# EAGLE design SPO2 New (EAGLE 7.7.0)
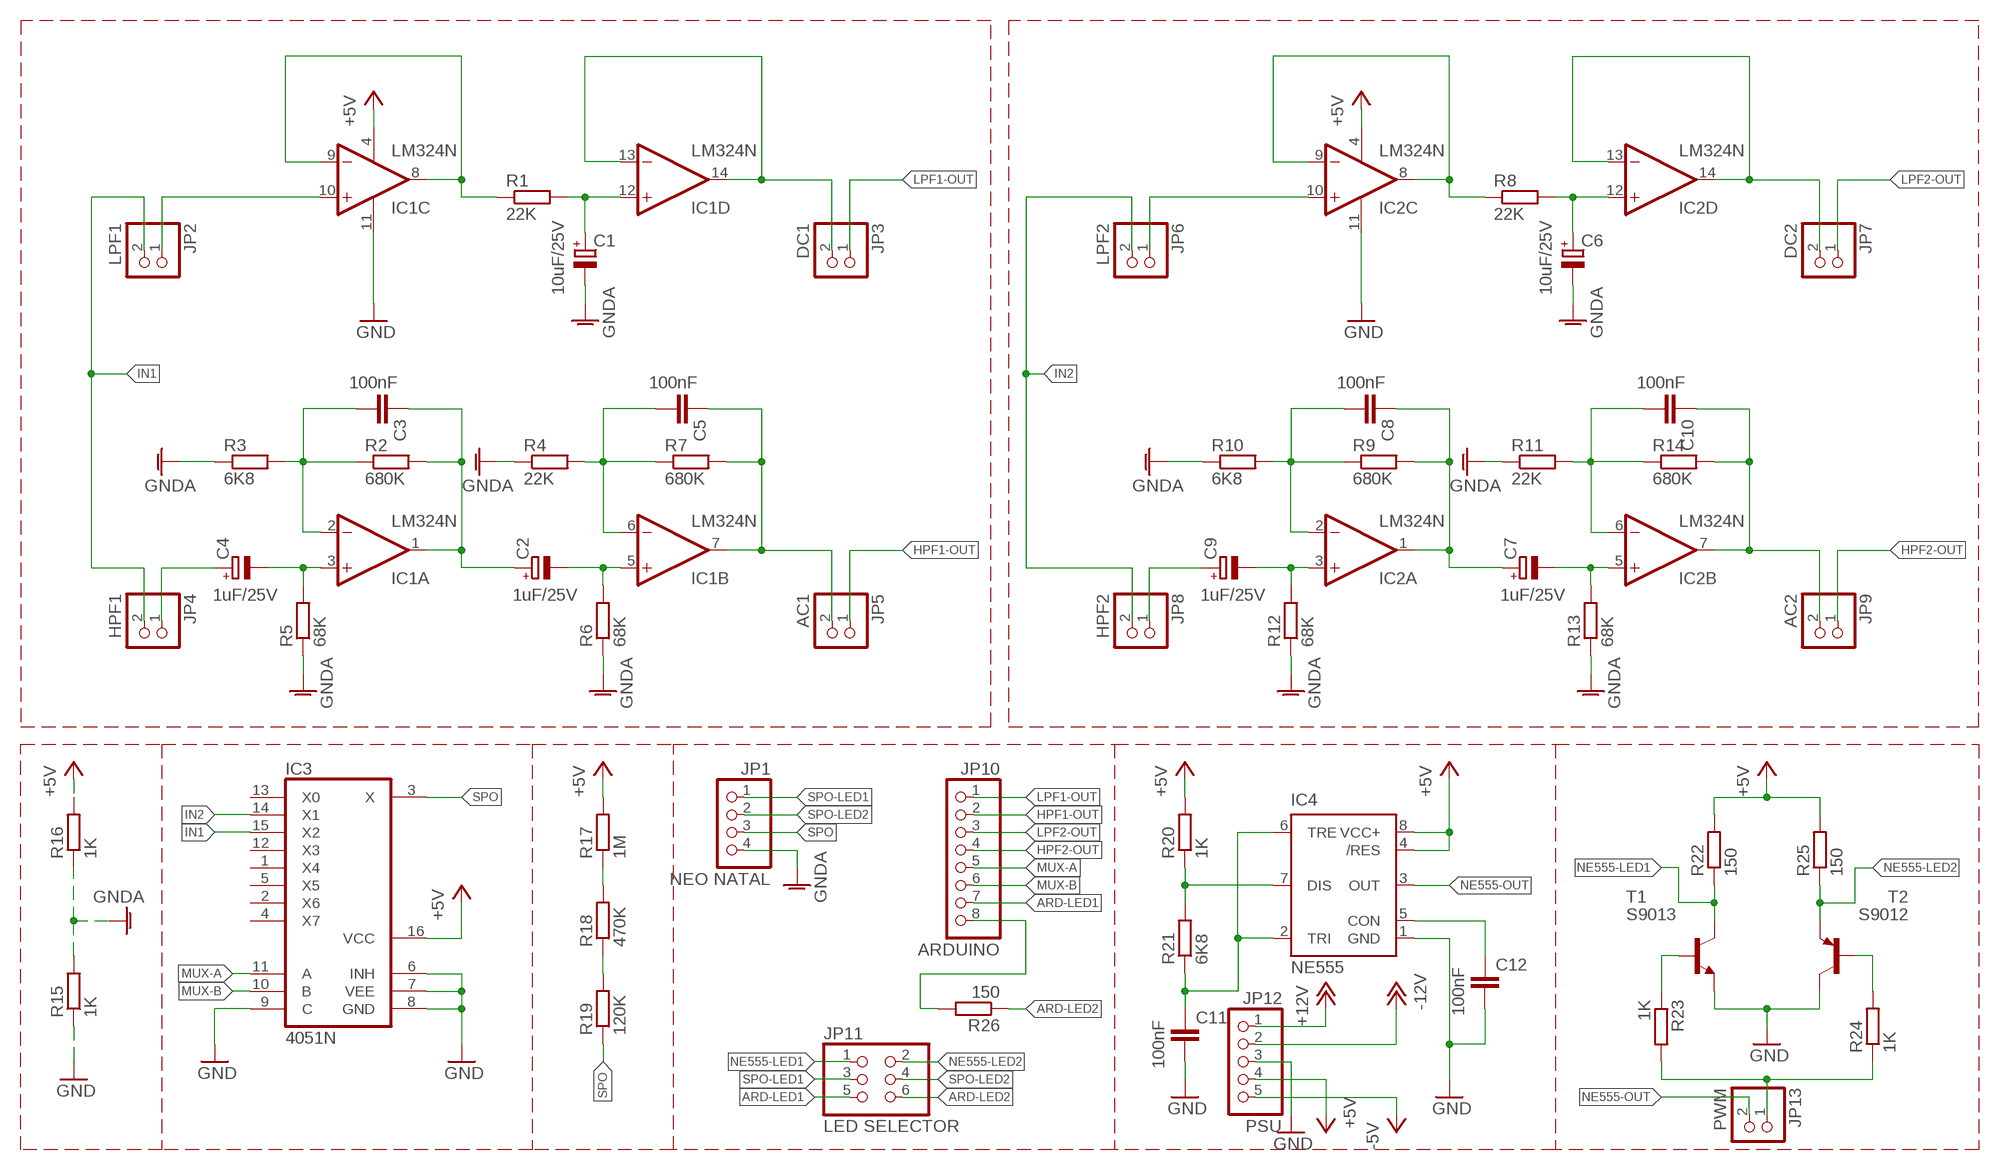
[diagram p0: schematic, sheet 1]

## Parts
C1  10uF/25V  CPOL-EUE2.5-6  [E2,5-6]
C2  1uF/25V  CPOL-EUE2.5-6  [E2,5-6]
C3  100nF  C-EU050-025X075  [C050-025X075]
C4  1uF/25V  CPOL-EUE2.5-6  [E2,5-6]
C5  100nF  C-EU050-025X075  [C050-025X075]
C6  10uF/25V  CPOL-EUE2.5-6  [E2,5-6]
C7  1uF/25V  CPOL-EUE2.5-6  [E2,5-6]
C8  100nF  C-EU050-025X075  [C050-025X075]
C9  1uF/25V  CPOL-EUE2.5-6  [E2,5-6]
C10  100nF  C-EU050-025X075  [C050-025X075]
C11  100nF  C-EU050-025X075  [C050-025X075]
C12  100nF  C-EU050-025X075  [C050-025X075]
IC1  LM324N  [DIL14]
IC2  LM324N  [DIL14]
IC3  4051N  [DIL16]
IC4  NE555  [DIL-08]
JP1  NEO NATAL  PINHD-1X4  [1X04]
JP2  LPF1  PINHD-1X2  [1X02]
JP3  DC1  PINHD-1X2  [1X02]
JP4  HPF1  PINHD-1X2  [1X02]
JP5  AC1  PINHD-1X2  [1X02]
JP6  LPF2  PINHD-1X2  [1X02]
JP7  DC2  PINHD-1X2  [1X02]
JP8  HPF2  PINHD-1X2  [1X02]
JP9  AC2  PINHD-1X2  [1X02]
JP10  ARDUINO  PINHD-1X8  [1X08]
JP11  LED SELECTOR  PINHD-2X3  [2X03]
JP12  PSU  PINHD-1X5"  [1X05]
JP13  PWM  PINHD-1X2  [1X02]
R1  22K  R-EU_0207/7  [0207/7]
R2  680K  R-EU_0207/7  [0207/7]
R3  6K8  R-EU_0207/7  [0207/7]
R4  22K  R-EU_0207/7  [0207/7]
R5  68K  R-EU_0207/7  [0207/7]
R6  68K  R-EU_0207/7  [0207/7]
R7  680K  R-EU_0207/7  [0207/7]
R8  22K  R-EU_0207/7  [0207/7]
R9  680K  R-EU_0207/7  [0207/7]
R10  6K8  R-EU_0207/7  [0207/7]
R11  22K  R-EU_0207/7  [0207/7]
R12  68K  R-EU_0207/7  [0207/7]
R13  68K  R-EU_0207/7  [0207/7]
R14  680K  R-EU_0207/7  [0207/7]
R15  1K  R-EU_0207/7  [0207/7]
R16  1K  R-EU_0207/7  [0207/7]
R17  1M  R-EU_0207/7  [0207/7]
R18  470K  R-EU_0207/7  [0207/7]
R19  120K  R-EU_0207/7  [0207/7]
R20  1K  R-EU_0207/7  [0207/7]
R21  6K8  R-EU_0207/7  [0207/7]
R22  150  R-EU_0207/7  [0207/7]
R23  1K  R-EU_0207/7  [0207/7]
R24  1K  R-EU_0207/7  [0207/7]
R25  150  R-EU_0207/7  [0207/7]
R26  150  R-EU_0207/7  [0207/7]
T1  S9013  BC319-NPN-TO92-EBC  [TO92-EBC]
T2  S9012  BC327-16-PNP-TO92-EBC  [TO92-EBC]

## Nets
+5V: IC1.4(P:V+) IC2.4(P:V+) IC3.16(VCC) IC4.4(/RES) IC4.8(VCC+) JP12.4 R16.2 R17.2 R20.2 R22.2 R25.2
+12V: JP12.1
-5V: JP12.5
-12V: JP12.2
ARD-LED1: JP10.7 JP11.5
ARD-LED2: JP11.6 R26.1
GND: C11.2 C12.2 IC1.11(P:V-) IC2.11(P:V-) IC3.6(INH) IC3.7(VEE) IC3.8(GND) IC3.9(C) IC4.1(GND) JP12.3 R15.1 T1.E T2.C
GNDA: C1.- C6.- JP1.4 R3.1 R4.1 R5.1 R6.1 R10.1 R11.1 R12.1 R13.1 R15.2 R16.1
HPF1-OUT: JP5.1 JP10.2
HPF2-OUT: JP9.1 JP10.4
IN1: IC3.15(X2) JP2.2 JP4.2
IN2: IC3.14(X1) JP6.2 JP8.2
LPF1-OUT: JP3.1 JP10.1
LPF2-OUT: JP7.1 JP10.3
MUX-A: IC3.11(A) JP10.5
MUX-B: IC3.10(B) JP10.6
N$1: C1.+ IC1.12(D:+IN) R1.2
N$2: IC1.13(D:-IN) IC1.14(D:OUT) JP3.2
N$3: IC1.8(C:OUT) IC1.9(C:-IN) R1.1
N$4: IC1.10(C:+IN) JP2.1
N$5: C6.+ IC2.12(D:+IN) R8.2
N$6: IC2.8(C:OUT) IC2.9(C:-IN) R8.1
N$7: C3.2 IC1.2(A:-IN) R2.1 R3.2
N$8: C5.2 IC1.6(B:-IN) R4.2 R7.1
N$9: C2.+ C3.1 IC1.1(A:OUT) R2.2
N$10: C2.- IC1.5(B:+IN) R6.2
N$11: C4.- IC1.3(A:+IN) R5.2
N$12: IC2.13(D:-IN) IC2.14(D:OUT) JP7.2
N$13: C4.+ JP4.1
N$14: C8.2 IC2.2(A:-IN) R9.1 R10.2
N$15: C7.+ C8.1 IC2.1(A:OUT) R9.2
N$16: C5.1 IC1.7(B:OUT) JP5.2 R7.2
N$17: C7.- IC2.5(B:+IN) R13.2
N$18: C10.2 IC2.6(B:-IN) R11.2 R14.1
N$19: C9.- IC2.3(A:+IN) R12.2
N$20: C9.+ JP8.1
N$21: C10.1 IC2.7(B:OUT) JP9.2 R14.2
N$22: IC2.10(C:+IN) JP6.1
N$23: IC4.7(DIS) R20.1 R21.2
N$24: R18.1 R19.2
N$25: R17.1 R18.2
N$26: C11.1 IC4.2(TRI) IC4.6(TRE) R21.1
N$27: C12.1 IC4.5(CON)
N$28: R24.2 T2.B
N$29: R23.1 T1.B
N$30: JP10.8 R26.2
N$35: JP13.1 R23.2 R24.1
NE555-LED1: JP11.1 R22.1 T1.C
NE555-LED2: JP11.2 R25.1 T2.E
NE555-OUT: IC4.3(OUT) JP13.2
SPO: IC3.3(X) JP1.3 R19.1
SPO-LED1: JP1.1 JP11.3
SPO-LED2: JP1.2 JP11.4
Unconnected: IC3.1(X4) IC3.2(X6) IC3.4(X7) IC3.5(X5) IC3.12(X3) IC3.13(X0)

## Library data of the parts
C1 C2 C4 C6 C7 C9 = FansElectronics-RCL:CPOL-EU: POLARIZED CAPACITOR, European symbol
C3 C5 C8 C10-C12 = FansElectronics-RCL:C-EU: CAPACITOR, European symbol
IC1 IC2 = linear:LM324: OP AMP
IC3 = 40xx:4051: 8-channel ANALOG MULTIPLEXER
IC4 = st-microelectronics:NE555: General purpose bipolar Timer; MF: Arrow Electronics; MPN: NE555N; OC_FARNELL: 1467742; OC_NEWARK: 89K1486
JP1 = FansElectronics-Header:PINHD-1X4: PIN HEADER
JP2-JP9 JP13 = FansElectronics-Header:PINHD-1X2: PIN HEADER
JP10 = FansElectronics-Header:PINHD-1X8: PIN HEADER
JP11 = FansElectronics-Header:PINHD-2X3: PIN HEADER
JP12 = FansElectronics-Header:PINHD-1X5: PIN HEADER
R1-R26 = FansElectronics-RCL:R-EU_: RESISTOR, European symbol
T1 = transistor:*-NPN-: NPN Transistror BF959 corrected 2008.03.06
T2 = transistor:*-PNP-: PNP Transistror

## Board
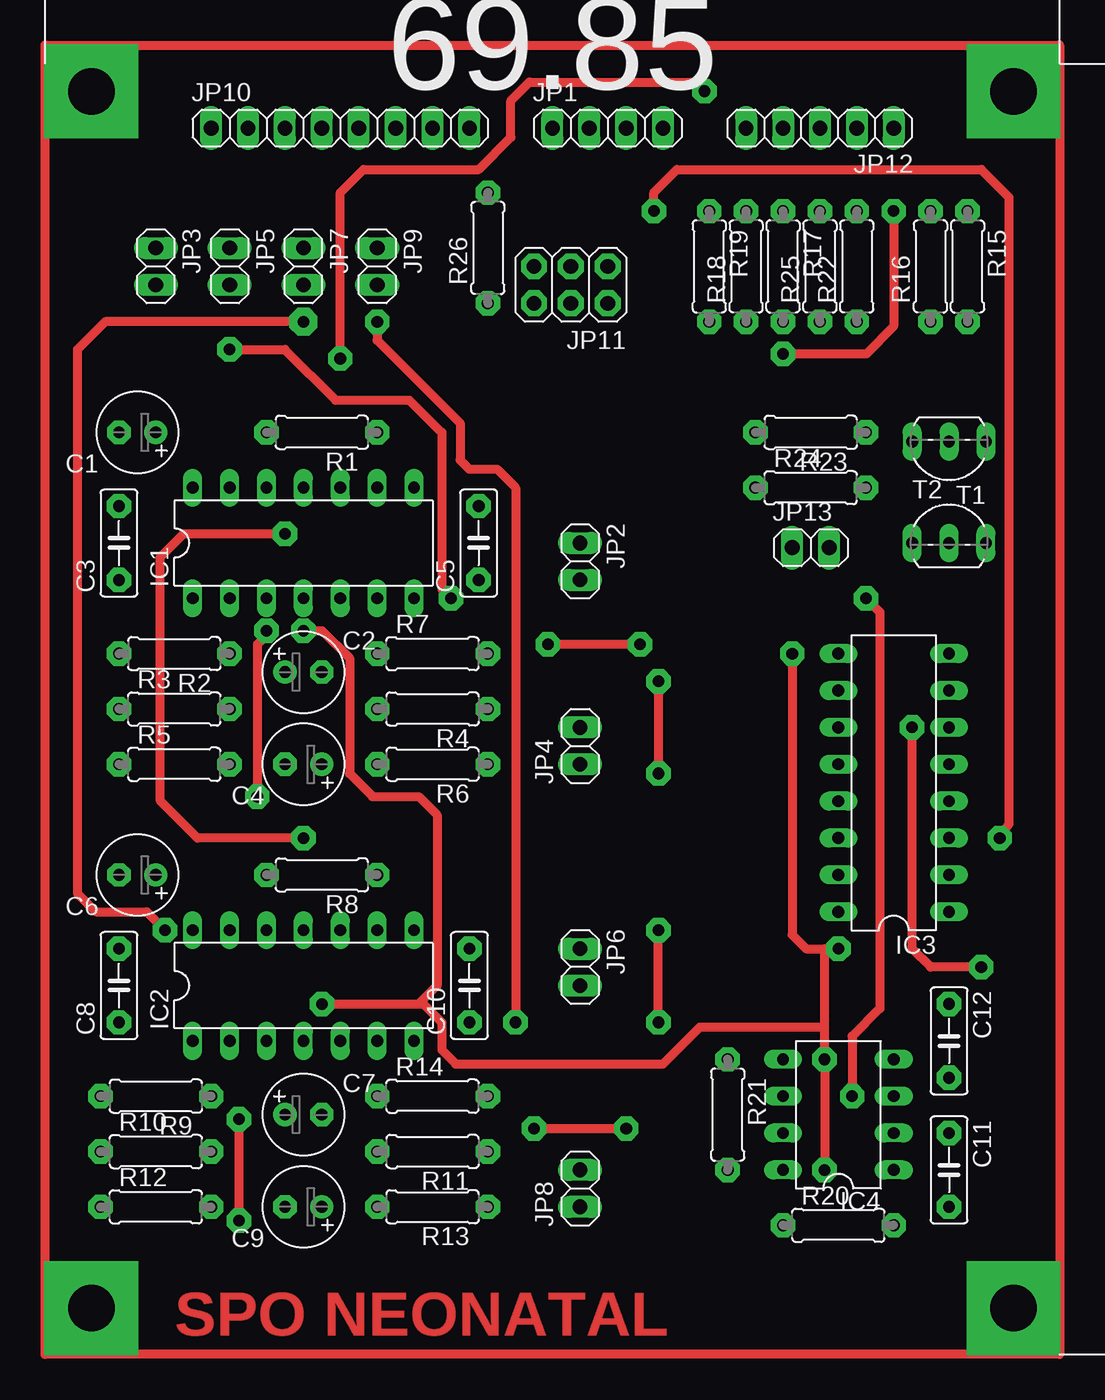
[diagram p1: board, top side]
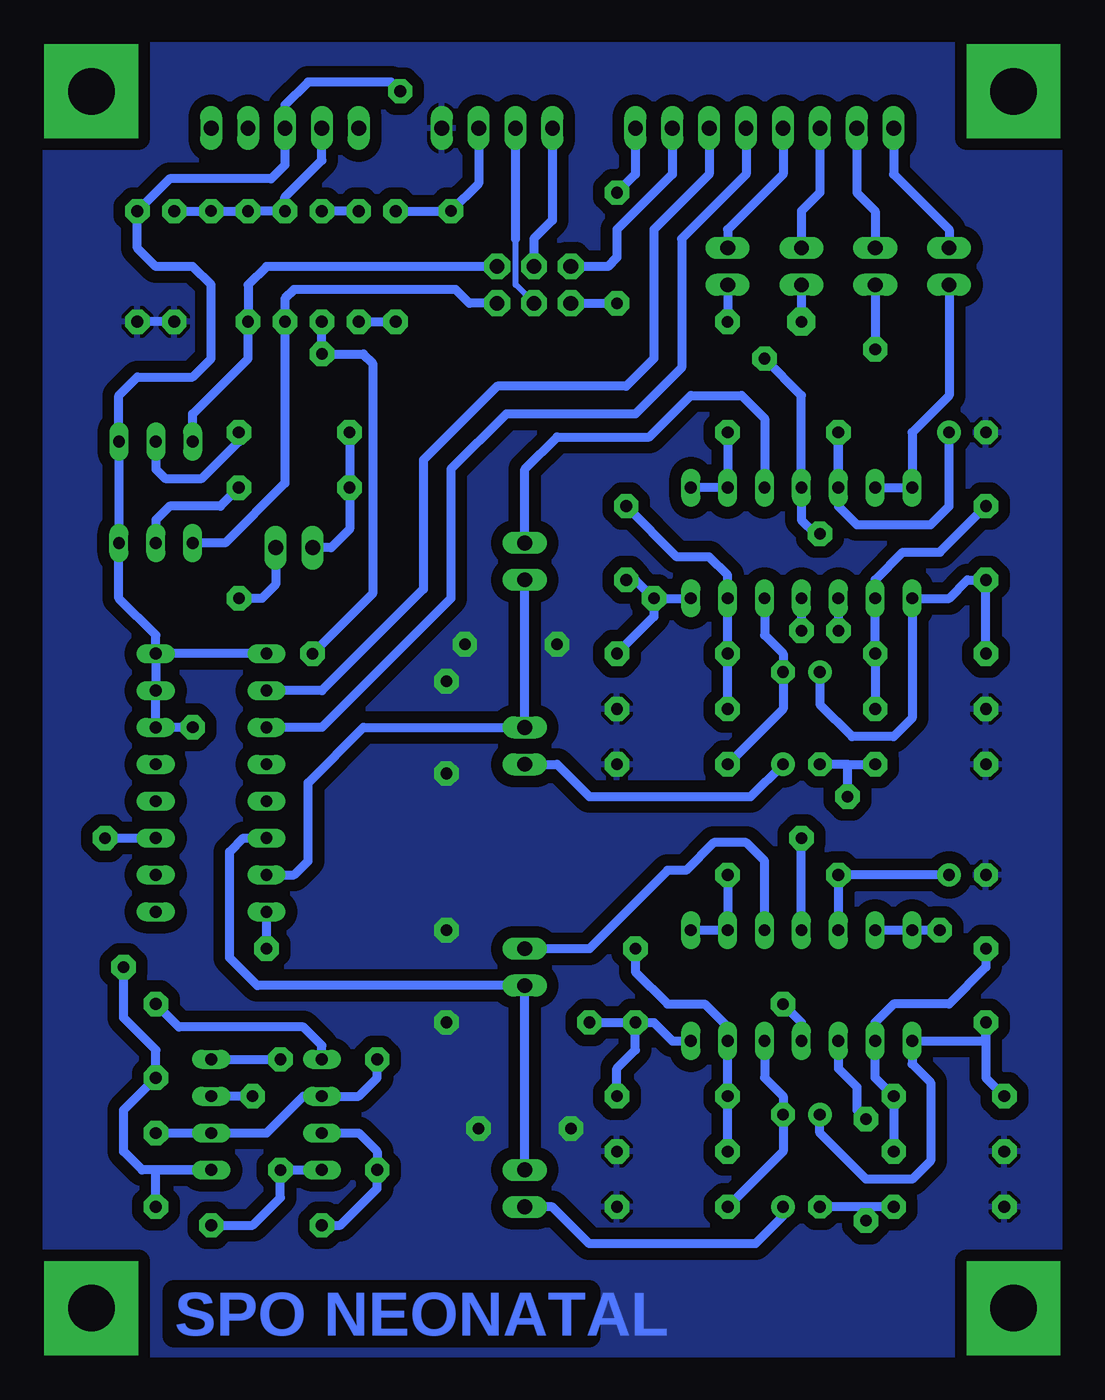
[diagram p2: board, bottom side, seen from below]

No outline drawn. Coordinates in mm, seen from the top.
Copper layers (1*16): Top 0.035mm / dielectric 1.5mm / Bottom 0.035mm
Design rules "default": minimum track width 10mil, minimum drill 24mil, track to track 8mil, track to pad 8mil, pad to pad 8mil, via to via 8mil, smd to smd 8mil, copper to edge 40mil, drill to drill 8mil, minimum pad ring 10mil, minimum via ring 8mil, stop-mask expansion 4mil, vias tented up to drill 0mil, thermal gap 10mil

### Footprints (pad centres in the part's own frame; a part is rotated, then mirrored left to right if it is on the bottom)
E2,5-6 = drill 0.813 pad 1.6: + -1.27,0 | drill 0.813 pad 1.6 octagon: - 1.27,0
C050-025X075 = drill 0.813 pad 1.676 octagon: 1 -2.54,0; 2 2.54,0
DIL14 = drill 0.813 long: 1 -7.62,-3.81; 2 -5.08,-3.81; 3 -2.54,-3.81; 4 0,-3.81; 5 2.54,-3.81; 6 5.08,-3.81; 7 7.62,-3.81; 8 7.62,3.81; 9 5.08,3.81; 10 2.54,3.81; 11 0,3.81; 12 -2.54,3.81; 13 -5.08,3.81; 14 -7.62,3.81
DIL16 = drill 0.813 long: 1 -8.89,-3.81; 2 -6.35,-3.81; 3 -3.81,-3.81; 4 -1.27,-3.81; 5 1.27,-3.81; 6 3.81,-3.81; 7 6.35,-3.81; 8 8.89,-3.81; 9 8.89,3.81; 10 6.35,3.81; 11 3.81,3.81; 12 1.27,3.81; 13 -1.27,3.81; 14 -3.81,3.81; 15 -6.35,3.81; 16 -8.89,3.81
DIL-08 = drill 0.813 long: 1 -3.81,-3.81; 2 -1.27,-3.81; 3 1.27,-3.81; 4 3.81,-3.81; 5 3.81,3.81; 6 1.27,3.81; 7 -1.27,3.81; 8 -3.81,3.81
1X04 = drill 1.016 long: 1 -3.81,0; 2 -1.27,0; 3 1.27,0; 4 3.81,0
1X02 = drill 1.016 long: 1 -1.27,0; 2 1.27,0
1X08 = drill 1.016 long: 1 -8.89,0; 2 -6.35,0; 3 -3.81,0; 4 -1.27,0; 5 1.27,0; 6 3.81,0; 7 6.35,0; 8 8.89,0
2X03 = drill 1.016 pad 1.778 octagon: 1 -2.54,-1.27; 2 -2.54,1.27; 3 0,-1.27; 4 0,1.27; 5 2.54,-1.27; 6 2.54,1.27
1X05 = drill 1.016 long: 1 -5.08,0; 2 -2.54,0; 3 0,0; 4 2.54,0; 5 5.08,0
0207/7 = drill 0.813 pad 1.676 octagon: 1 -3.81,0; 2 3.81,0
TO92-EBC = drill 0.813 long: B 0,-1.27; C 2.54,-1.27; E -2.54,-1.27

### Placement (x,y rotation side)
C1  34.29,95.25 180 top
C2  45.72,78.74 0 top
C3  33.02,87.63 90 top
C4  45.72,72.39 180 top
C5  57.78,87.63 90 top
C6  34.29,64.77 180 top
C7  45.72,48.26 0 top
C8  33.02,57.15 90 top
C9  45.72,41.91 180 top
C10  57.15,57.15 90 top
C11  90.17,44.45 270 top
C12  90.17,53.34 270 top
IC1  45.72,87.63 0 top
IC2  45.72,57.15 0 top
IC3  86.36,71.12 90 top
IC4  82.55,48.26 90 top
JP1  66.67,116.2 0 top
JP2  64.77,86.36 270 top
JP3  35.56,106.68 270 top
JP4  64.77,73.66 90 top
JP5  40.64,106.68 270 top
JP6  64.77,58.42 270 top
JP7  45.72,106.68 270 top
JP8  64.77,43.18 90 top
JP9  50.8,106.68 270 top
JP10  48.26,116.2 0 top
JP11  64.14,105.41 180 top
JP12  81.28,116.2 180 top
JP13  80.64,87.31 0 top
R1  46.99,95.25 180 top
R2  36.83,80.01 180 top
R3  36.83,76.2 0 top
R4  54.61,76.2 180 top
R5  36.83,72.39 0 top
R6  54.61,72.39 180 top
R7  54.61,80.01 0 top
R8  46.99,64.77 180 top
R9  35.56,49.53 180 top
R10  35.56,45.72 0 top
R11  54.61,45.72 180 top
R12  35.56,41.91 0 top
R13  54.61,41.91 180 top
R14  54.61,49.53 0 top
R15  91.44,106.68 270 top
R16  88.9,106.68 90 top
R17  78.74,106.68 270 top
R18  76.2,106.68 90 top
R19  73.66,106.68 270 top
R20  82.55,40.64 0 top
R21  74.93,48.26 270 top
R22  83.82,106.68 90 top
R23  80.64,95.25 180 top
R24  80.64,91.44 0 top
R25  81.28,106.68 90 top
R26  58.42,107.95 90 top
T1  90.17,93.34 180 top
T2  90.17,88.9 0 top

### Tracks (layer width: path | path; a pad name or v marks a point on that pad's centre or on a via)
+5V  (via drill 0.8 pad 1.68)
  Top 0.61: v86.36,110.49 86.36,102.55 84.45,100.65 v78.74,100.65 | v81.6,44.45 v81.6,52.07 81.6,54.29 | 81.6,54.29 81.6,59.69 | 81.6,54.29 73.03,54.29 70.48,51.75 56.2,51.75 55.24,52.7 55.24,54.61 53.98,55.88 v46.99,55.88 53.66,55.88 54.93,57.15 54.93,68.9 53.66,70.17 50.48,70.17 48.9,71.75 48.9,79.69 46.99,81.6 v45.72,81.6 | v79.38,80.01 79.38,60.64 80.33,59.69 81.6,59.69 | 81.6,59.69 v82.55,59.69
  Bottom 0.61: JP12.4 78.74,113.98 81.28,111.44 R25.2 R22.2 v86.36,110.49 R16.2 | R17.2 v78.74,100.65 75.88,100.65 75.25,100.01 75.25,84.14 v79.38,80.01 | IC4.4 v81.6,52.07 | IC4.8 v81.6,44.45 81.6,42.55 83.5,40.64 R20.2 | v82.55,59.69 IC3.16 | IC2.4 45.72,54.61 v46.99,55.88 | IC1.4 v45.72,81.6
ARD-LED1
  Bottom 0.61: JP10.7 54.61,113.03 58.42,109.22 58.42,107.31 59.05,106.68 JP11.5
ARD-LED2
  Bottom 0.61: JP11.6 R26.1
GND  (via drill 0.8 pad 1.68)
  Top 0.61: v48.26,100.33 48.26,111.76 49.85,113.35 57.78,113.35 60.01,115.57 60.01,118.11 61.28,119.38 72.71,119.38 v73.34,118.75 | v92.39,58.42 88.9,58.42 87.63,59.69 v87.63,74.93 | v45.72,67.31 38.42,67.31 35.88,69.85 35.88,86.68 37.47,88.27 v44.45,88.27
  Bottom 0.61: IC3.9 IC3.8 | IC3.8 IC3.7 IC3.6 v87.63,74.93 | IC3.8 90.17,81.28 92.71,83.82 T2.C T1.E 92.71,97.79 91.44,99.06 87.63,99.06 86.36,100.33 86.36,105.41 87.63,106.68 90.17,106.68 91.44,107.95 R15.1 89.22,112.71 82.23,112.71 81.28,113.67 JP12.3 81.28,117.79 79.69,119.38 73.98,119.38 v73.34,118.75 | v48.26,100.33 45.72,97.79 IC1.11 45.72,89.22 44.77,88.27 v44.45,88.27 | C11.2 90.17,44.45 IC4.1 91.12,44.45 92.39,45.72 92.39,48.58 C12.2 90.17,52.7 92.39,54.93 v92.39,58.42 | IC2.11 v45.72,67.31
GNDA  (via drill 0.8 pad 1.68)
  Top 0.61: v61.59,47.31 v67.94,47.31 | v68.9,80.64 v62.55,80.64 | v70.17,78.11 v70.17,71.75 | v70.17,54.61 v70.17,60.96
  Bottom 0.61: R16.1 R15.2
  pour Bottom (isolate 0.813): 27.94,121.92 97.79,121.92 97.79,31.75 27.94,31.75
HPF1-OUT
  Bottom 0.61: JP10.2 41.91,111.76 40.64,110.49 JP5.1
HPF2-OUT
  Bottom 0.61: JP10.4 46.99,113.03 50.8,109.22 JP9.1
IN1
  Bottom 0.61: JP2.2 JP4.2 75.88,74.93 79.69,71.12 79.69,65.72 80.64,64.77 IC3.15
IN2
  Bottom 0.61: JP8.2 JP6.2 83.19,57.15 85.09,59.05 85.09,66.36 84.14,67.31 IC3.14
LPF1-OUT
  Bottom 0.61: JP10.1 39.37,113.03 35.56,109.22 JP3.1
LPF2-OUT
  Bottom 0.61: JP10.3 44.45,111.76 45.72,110.49 JP7.1
MUX-A
  Bottom 0.61: JP10.5 49.53,113.03 53.98,108.58 53.98,99.69 57.15,96.52 66.04,96.52 69.85,92.71 69.85,83.82 78.74,74.93 IC3.11
MUX-B
  Bottom 0.61: JP10.6 52.07,113.03 55.88,109.22 55.88,100.33 57.78,98.42 66.67,98.42 71.75,93.34 71.75,84.45 78.74,77.47 IC3.10
N$1
  Bottom 0.61: IC1.12 R1.2 43.18,90.17 41.91,88.9 36.83,88.9 35.56,90.17 C1.+
N$2
  Bottom 0.61: JP3.2 35.56,97.79 38.1,95.25 IC1.14 IC1.13
N$3
  Bottom 0.61: R1.1 IC1.9 IC1.8
N$4
  Bottom 0.61: JP2.1 64.77,92.71 62.55,94.93 56.2,94.93 53.34,97.79 49.85,97.79 48.26,96.2 IC1.10
N$5
  Bottom 0.61: C6.+ R8.2 IC2.12
N$6
  Bottom 0.61: IC2.8 IC2.9 R8.1
N$7
  Bottom 0.61: C3.2 36.2,87 38.73,87 40.64,85.09 IC1.2 R2.1 R3.2
N$8
  Bottom 0.61: C5.2 54.29,86.68 52.07,86.68 50.8,85.41 IC1.6 R7.1 R4.2
N$9
  Bottom 0.61: R2.2 C3.1 34.29,85.09 35.56,83.82 IC1.1 38.1,75.56 39.37,74.3 42.23,74.3 44.45,76.52 C2.+
N$10
  Bottom 0.61: IC1.5 48.26,81.28 46.99,80.01 C2.- 46.99,76.2 R6.2
N$11  (via drill 0.8 pad 1.68)
  Top 0.61: v43.18,81.6 43.18,81.28 42.55,80.64 v42.55,70.17
  Bottom 0.61: IC1.3 v43.18,81.6 | v42.55,70.17 42.55,72.39 | 42.55,72.39 R5.2 | 42.55,72.39 C4.-
N$12  (via drill 0.8 pad 1.68, 0.8 pad 1.93)
  Top 0.61: v45.72,102.87 32.07,102.87 30.16,100.97 30.16,63.5 31.43,62.23 34.92,62.23 v36.2,60.96
  Bottom 0.61: IC2.13 IC2.14 v36.2,60.96 | JP7.2 v45.72,102.87
N$13
  Bottom 0.61: JP4.1 62.55,72.39 60.33,70.17 49.21,70.17 C4.+
N$14
  Bottom 0.61: C8.2 33.02,58.42 35.56,55.88 39.37,55.88 40.64,54.61 IC2.2 40.64,50.8 R9.1 R10.2
N$15
  Bottom 0.61: R9.2 33.02,50.8 C8.1 33.02,53.34 IC2.1 38.1,51.75 36.83,50.48 36.83,45.09 38.1,43.81 41.27,43.81 44.45,46.99 C7.+
N$16  (via drill 0.8 pad 1.68)
  Top 0.61: v40.64,100.97 44.45,100.97 47.94,97.47 53.02,97.47 55.24,95.25 55.24,84.45 v55.88,83.82
  Bottom 0.61: JP5.2 v40.64,100.97 | v55.88,83.82 IC1.7 | C5.1 57.15,85.09 v55.88,83.82 | v55.88,83.82 55.88,82.55 R7.2
N$17
  Bottom 0.61: IC2.5 48.26,50.8 46.99,49.53 C7.- 46.99,45.72 R13.2
N$18
  Bottom 0.61: C10.2 57.15,58.1 54.93,55.88 52.39,55.88 50.8,54.29 IC2.6 R14.1 R11.2
N$19  (via drill 0.8 pad 1.68)
  Top 0.61: v41.27,47.94 v41.27,40.96
  Bottom 0.61: R12.2 41.27,41.91 | 41.27,41.91 C9.- | IC2.3 43.18,51.44 41.91,50.16 41.91,48.58 v41.27,47.94 | v41.27,40.96 41.27,41.91
N$20
  Bottom 0.61: C9.+ 46.99,41.27 48.9,39.37 60.33,39.37 62.87,41.91 JP8.1
N$21  (via drill 0.8 pad 1.68)
  Top 0.61: v50.8,102.87 50.8,101.6 56.52,95.89 56.52,93.34 57.15,92.71 59.05,92.71 60.33,91.44 v60.33,54.61
  Bottom 0.61: JP9.2 v50.8,102.87 | v60.33,54.61 C10.1 | C10.1 55.88,54.61 54.61,53.34 IC2.7 | R14.2 58.42,51.44 57.15,52.7 C10.1
N$22
  Bottom 0.61: IC2.10 48.26,65.72 49.53,66.99 51.75,66.99 53.66,65.09 54.93,65.09 60.33,59.69 JP6.1
N$23
  Bottom 0.61: IC4.7 76.2,46.99 74.93,45.72 R21.2 74.93,43.18 77.47,40.64 R20.1
N$24
  Bottom 0.61: R18.1 R19.2
N$25
  Bottom 0.61: R18.2 R17.1
N$26
  Bottom 0.61: C11.1 IC4.2 82.55,46.99 80.01,49.53 IC4.6 76.2,49.53 74.93,50.8 R21.1
N$27
  Bottom 0.61: IC4.5 78.74,53.02 80.01,54.29 88.58,54.29 C12.1
N$28
  Bottom 0.61: R24.2 85.72,90.17 89.22,90.17 90.17,89.22 T2.B
N$29
  Bottom 0.61: T1.B 90.17,92.71 89.53,92.08 87,92.08 84.45,94.61 R23.1
N$30
  Bottom 0.61: JP10.8 57.15,113.03 R26.2
N$31  (via drill 3.2 pad 6.45)
  other vias: 31.11,118.75
N$32  (via drill 3.2 pad 6.45)
  other vias: 94.61,118.75
N$33  (via drill 3.2 pad 6.45)
  other vias: 94.61,34.92
N$34  (via drill 3.2 pad 6.45)
  other vias: 31.11,34.92
N$35
  Bottom 0.61: R23.2 R24.1 76.83,88.58 78.11,87.31 JP13.1
N$36
  Top 0.61: 27.94,121.92 97.79,121.92 97.79,31.75 27.94,31.75 27.94,121.92
NE555-LED1
  Bottom 0.61: JP11.1 82.55,106.68 83.82,105.41 R22.1 83.82,100.33 87.63,96.52 T1.C
NE555-LED2
  Bottom 0.61: JP11.2 68.58,104.14 69.53,105.09 80.64,105.09 81.28,104.46 R25.1 81.28,91.76 85.41,87.63 T2.E
NE555-OUT  (via drill 0.8 pad 1.68)
  Top 0.61: v84.45,83.82 85.41,82.87 85.41,55.56 83.5,53.66 v83.5,49.53
  Bottom 0.61: JP13.2 81.92,84.77 82.87,83.82 v84.45,83.82 | v83.5,49.53 IC4.3
SPO  (via drill 0.8 pad 1.68)
  Top 0.61: v69.85,110.49 69.85,111.76 71.44,113.35 92.39,113.35 94.3,111.44 94.3,68.26 v93.66,67.31
  Bottom 0.61: JP1.3 67.94,112.39 v69.85,110.49 R19.1 | v93.66,67.31 IC3.3
SPO-LED1
  Bottom 0.61: JP1.1 62.87,109.86 64.14,108.58 JP11.3
SPO-LED2
  Bottom 0.406: JP11.4 65.41,105.41 65.41,108.58
  Bottom 0.61: 65.41,108.58 JP1.2

### Text on the board
Top: SPO NEONATAL
Bottom: SPO NEONATAL